# Altium schematic sheet mcu.SchDoc
size A
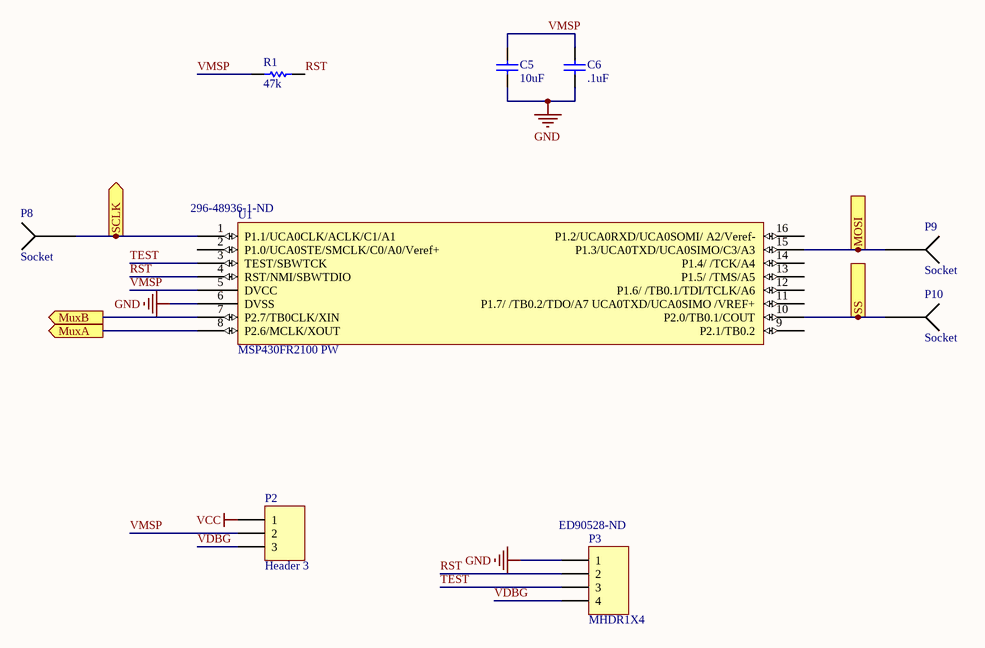
[diagram p0: mcu.SchDoc]

## Parts
C5  value 10uF  [0603]  (hidden comment: Cap)
C6  value .1uF  [0603]  (hidden comment: Cap)
P2  Header 3  [HDR1X3]
P3  MHDR1X4  Supplier Part Number 1: ED90528-ND  [MHDR1X4]
P8  Socket  [socket]
P9  Socket  [socket]
P10  Socket  [socket]
R1  value 47k  [0603]  (hidden comment: Res)
U1  MSP430FR2100 PW  Supplier Part Number 1: 296-48936-1-ND  [TSOP65P640X120-16N]

## Ports
MOSI (out), MuxA (out), MuxB (out), SCLK (out), SS (out)

## Nets
GND: C5.1 C6.1 P3.1 U1.6(DVSS)
VCC: P2.1
MOSI: P9.0 U1.15(P1.3/UCA0TXD/UCA0SIMO/C3/A3) ; port MOSI
MuxA: U1.8(P2.6/MCLK/XOUT) ; port MuxA
MuxB: U1.7(P2.7/TB0CLK/XIN) ; port MuxB
RST: P3.2 R1.2 U1.4(RST/NMI/SBWTDIO)
SCLK: P8.0 U1.1(P1.1/UCA0CLK/ACLK/C1/A1) ; port SCLK
SS: P10.0 U1.10(P2.0/TB0.1/COUT) ; port SS
TEST: P3.3 U1.3(TEST/SBWTCK)
VDBG: P2.3 P3.4
VMSP: C5.2 C6.2 P2.2 R1.1 U1.5(DVCC)

Not connected (* = marked no-connect by the designer): U1 2(P1.0/UCA0STE/SMCLK/C0/A0/Veref+) 9(P2.1/TB0.2) 11(P1.7/_/TB0.2/TDO/A7_UCA0TXD/UCA0SIMO_/VREF+) 12(P1.6/_/TB0.1/TDI/TCLK/A6) 13(P1.5/_/TMS/A5) 14(P1.4/_/TCK/A4) 16(P1.2/UCA0RXD/UCA0SOMI/_A2/Veref-)

## Library data of the parts
C5 C6 = Cap: Ceramic Capacitor (Surface Mount); Manufacturer: Generic Ceramic Chip Cap (TBD); Digi-Key Part Number: *; Manufacturer Part Number: *; Note: *; Rating: *
P2 = Header 3: Header, 3-Pin; LatestRevisionDate: 17-Jul-2002; LatestRevisionNote: Re-released for DXP Platform.; Publisher: Altium Limited
P3 = MHDR1X4: Header, 4-Pin; LatestRevisionDate: 17-Jul-2002; LatestRevisionNote: Re-released for DXP Platform.; Publisher: Altium Limited; Supplier 1: Digi-Key
R1 = Res: Chip Resistor (Surface Mount); Manufacturer: Generic Chip Res (TBD); Manufacturer Part Number: *; Digi-Key Part Number: *; Rating: *
U1 = MSP430FR2100 PW: ComponentLink1Description: Datasheet; ComponentLink1URL: http://www.ti.com/lit/ds/symlink/msp430fr2100.pdf; ComponentLink2Description: DigiKey; ComponentLink2URL: https://www.digikey.com/product-detail/en/texas-instruments/MSP430FR2100IPW16R/296-48936-1-ND/8634999; Supplier 1: Digi-Key